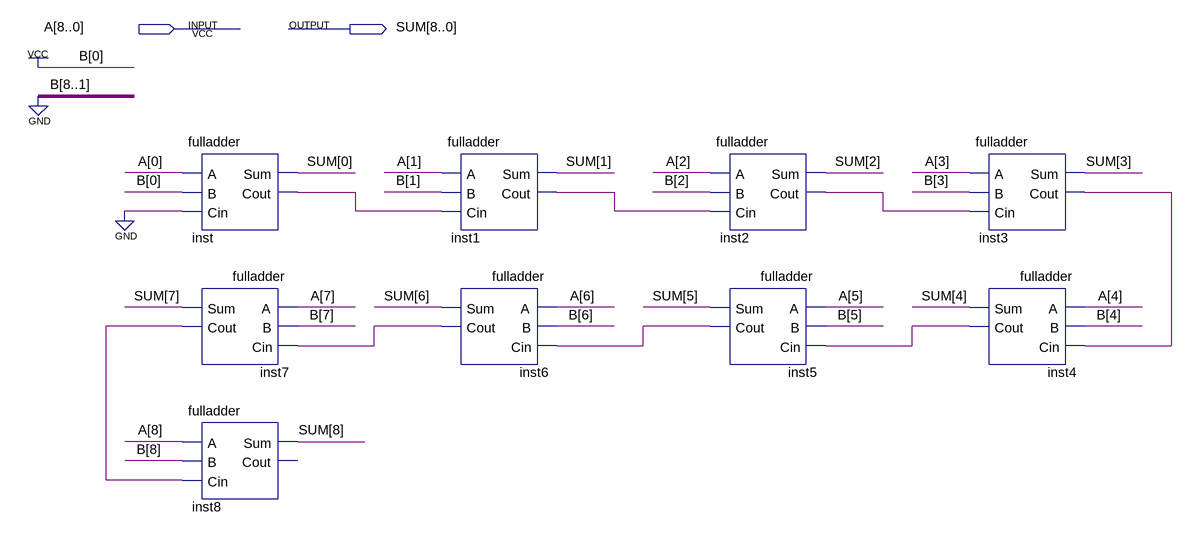
[diagram p0: schematic sheet]
// Quartus schematic Add1_8bit.bdf as structural Verilog: 9 symbols, 2 pins
module Add1_8bit (
  input  [8:0] A,
  output [8:0] SUM
);

  wire inst1_cout, inst2_cout, inst3_cout, inst4_cout, inst5_cout, inst6_cout, inst7_cout, inst_cout;

  fulladder inst (.A(A[0]), .B(1'b1), .Cin(1'b0), .Sum(SUM[0]), .Cout(inst_cout));
  fulladder inst7 (.A(A[7]), .B(1'b0), .Cin(inst6_cout), .Sum(SUM[7]), .Cout(inst7_cout));
  fulladder inst8 (.A(A[8]), .B(1'b0), .Cin(inst7_cout), .Sum(SUM[8]));  // open: Cout
  fulladder inst1 (.A(A[1]), .B(1'b0), .Cin(inst_cout), .Sum(SUM[1]), .Cout(inst1_cout));
  fulladder inst6 (.A(A[6]), .B(1'b0), .Cin(inst5_cout), .Sum(SUM[6]), .Cout(inst6_cout));
  fulladder inst2 (.A(A[2]), .B(1'b0), .Cin(inst1_cout), .Sum(SUM[2]), .Cout(inst2_cout));
  fulladder inst5 (.A(A[5]), .B(1'b0), .Cin(inst4_cout), .Sum(SUM[5]), .Cout(inst5_cout));
  fulladder inst3 (.A(A[3]), .B(1'b0), .Cin(inst2_cout), .Sum(SUM[3]), .Cout(inst3_cout));
  fulladder inst4 (.A(A[4]), .B(1'b0), .Cin(inst3_cout), .Sum(SUM[4]), .Cout(inst4_cout));
endmodule
